# EAGLE design single_channel_-_Rev_C_-_Part_1 (EAGLE 6.1)
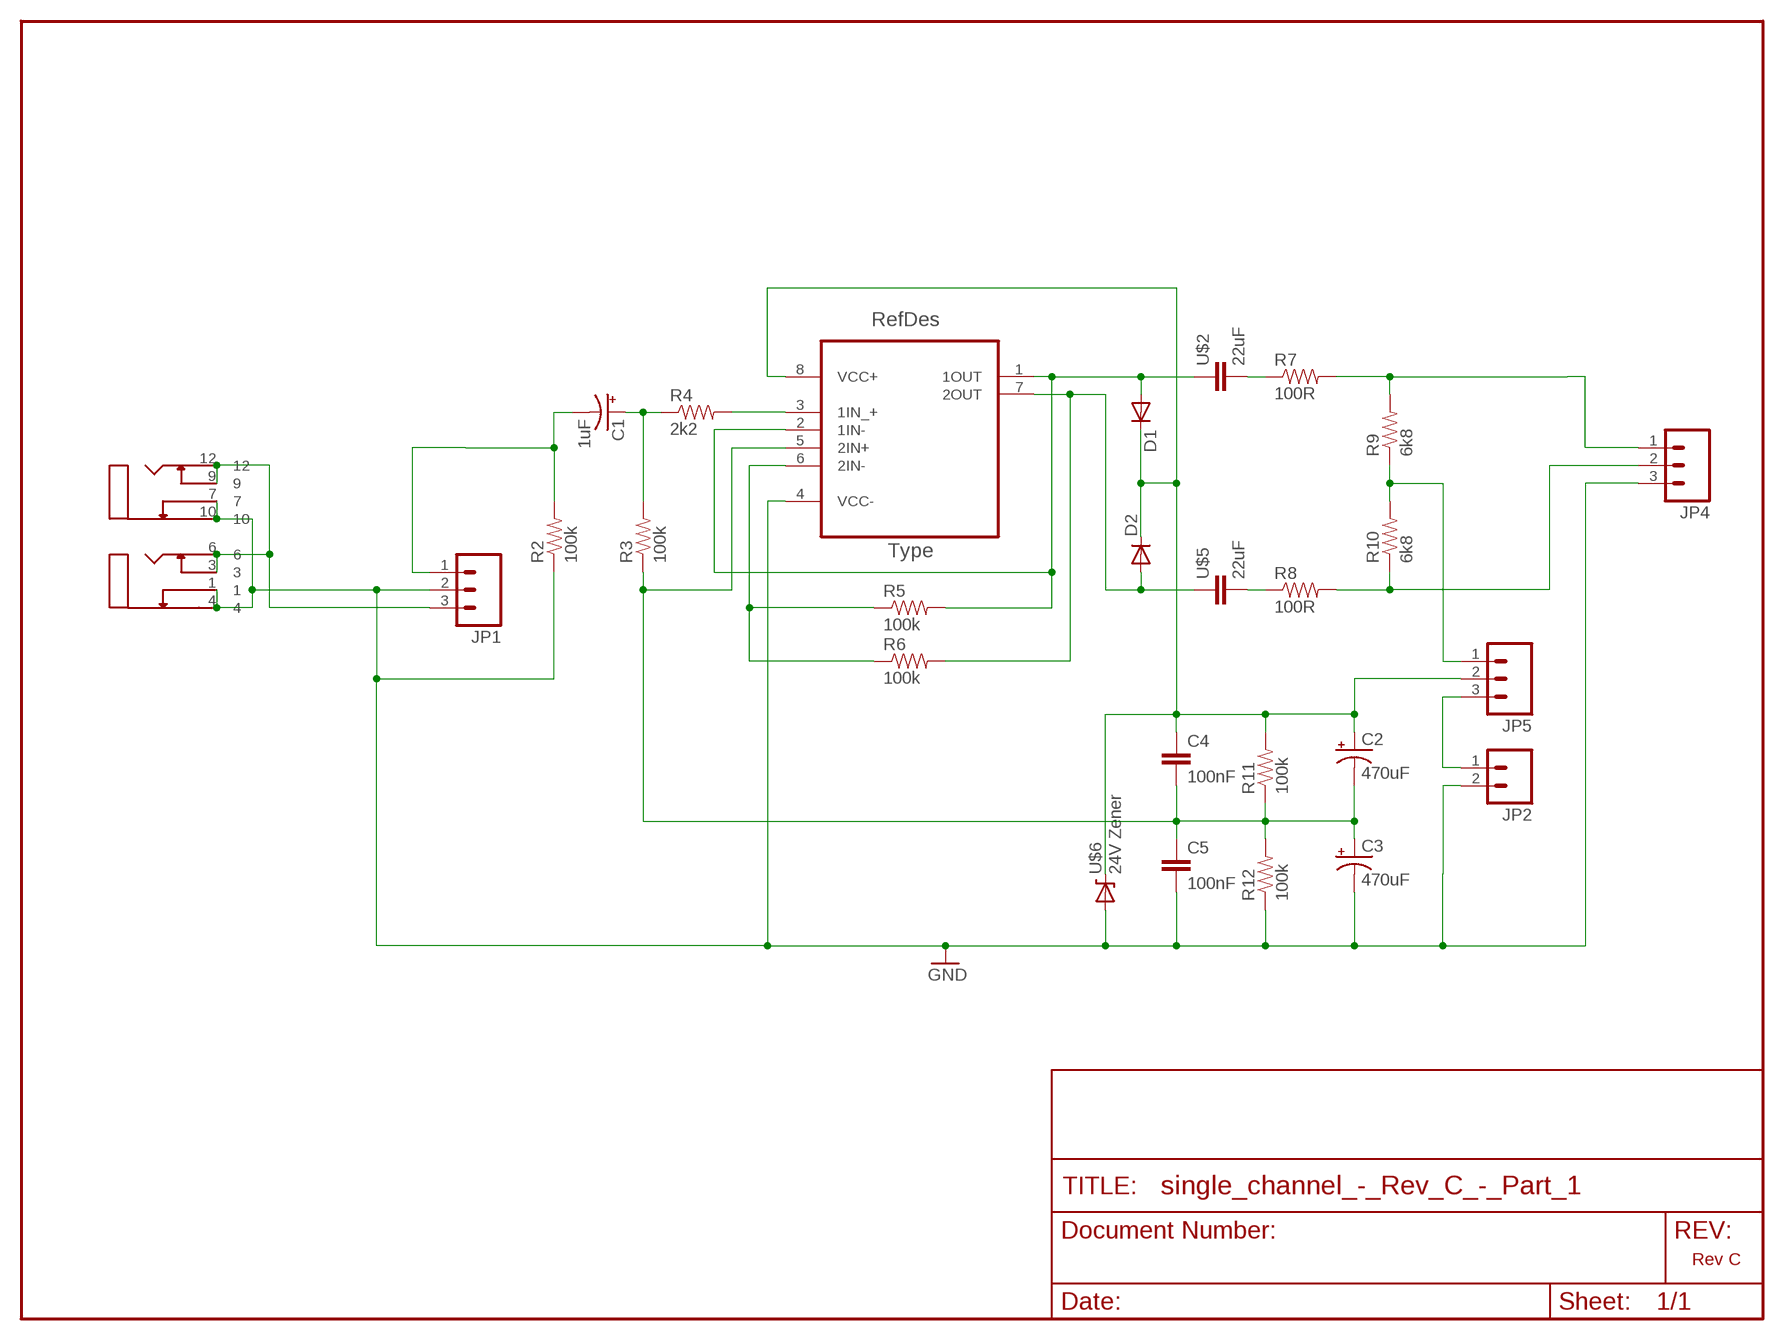
[diagram p0: schematic, sheet 1]

## Parts
C1  1uF  CAP_POLPTH2  [CPOL-RADIAL-10UF-25V]
C2  470uF  CAP_POLPTH4  [CPOL-RADIAL-1000UF-25V]
C3  470uF  CAP_POLPTH4  [CPOL-RADIAL-1000UF-25V]
C4  100nF  CAPPTH1  [CAP-PTH-5MM]
C5  100nF  CAPPTH1  [CAP-PTH-5MM]
D1  DIODE1N4148  [DIODE-1N4148]
D2  DIODE1N4148  [DIODE-1N4148]
J1  ACJMMHD  [MHD]
JP1  M03LONGPADS  [1X03_LONGPADS]
JP2  M02PTH3  [1X02_LONGPADS]
JP4  M03LONGPADS  [1X03_LONGPADS]
JP5  M03LONGPADS  [1X03_LONGPADS]
R2  100k  RESISTORPTH-1/2W  [AXIAL-0.5]
R3  100k  RESISTORPTH-1/2W  [AXIAL-0.5]
R4  2k2  RESISTORPTH-1/2W  [AXIAL-0.5]
R5  100k  RESISTORPTH-1/2W  [AXIAL-0.5]
R6  100k  RESISTORPTH-1/2W  [AXIAL-0.5]
R7  100R  RESISTORPTH-1/2W  [AXIAL-0.5]
R8  100R  RESISTORPTH-1/2W  [AXIAL-0.5]
R9  6k8  RESISTORPTH-1/2W  [AXIAL-0.5]
R10  6k8  RESISTORPTH-1/2W  [AXIAL-0.5]
R11  100k  RESISTORPTH-1/2W  [AXIAL-0.5]
R12  100k  RESISTORPTH-1/2W  [AXIAL-0.5]
U1  TL072CP  [DIP254P762X508-8]
U$2  22uF  CAP8MM  [8MM]
U$5  22uF  CAP8MM  [8MM]
U$6  24V Zener  DIODE-ZENERPTH  [DIODE-ZENER]

## Nets
GND: C3.2(-) C5.2 J1.1 J1.4 J1.7 J1.10 JP1.2 JP2.2 JP4.3 R2.P$1 R12.P$1 U1.4(VCC-) U$6.P$2(A)
N$2: J1.3 J1.6 J1.9 J1.12 JP1.3
N$5: C1.2(-) JP1.1 R2.P$2
N$6: C1.1(+) R3.P$2 R4.P$1
N$7: D1.A R5.P$2 U1.1(1OUT) U1.2(1IN-) U$2.P$1
N$8: R4.P$2 U1.3(1IN_+)
N$9: R5.P$1 R6.P$1 U1.6(2IN-)
N$10: C2.2(-) C3.1(+) C4.2 C5.1 R3.P$1 R11.P$1 R12.P$2 U1.5(2IN+)
N$11: C2.1(+) C4.1 D1.C D2.C JP5.2 R11.P$2 U1.8(VCC+) U$6.P$1(C)
N$12: D2.A R6.P$2 U1.7(2OUT) U$5.P$1
N$13: JP4.2 R8.P$2 R10.P$1
N$14: JP5.1 R9.P$1 R10.P$2
N$15: JP4.1 R7.P$2 R9.P$2
N$16: R7.P$1 U$2.P$2
N$17: R8.P$1 U$5.P$2
N$19: JP2.1 JP5.3

## Notes on the sheet
- Rev C

## Library data of the parts
C1 = SparkFun:CAP_POL: Capacitor Polarized These are standard SMD and PTH capacitors. Normally 10uF, 47uF, and 100uF in electrolytic and tantalum varieties. Always verify the external diameter of the through hole cap, it varies with capacity, voltage, and manufacturer. The EIA devices should be standard.
C2 C3 = SparkFun-Passives:CAP_POL: Capacitor Polarized These are standard SMD and PTH capacitors. Normally 10uF, 47uF, and 100uF in electrolytic and tantalum varieties. Always verify the external diameter of the through hole cap, it varies with capacity, voltage, and manufacturer. The EIA devices should be standard.
C4 C5 = SparkFun:CAP: Capacitor Standard 0603 ceramic capacitor, and 0.1" leaded capacitor.
D1 D2 = SparkFun:DIODE: Diode These are standard reverse protection diodes and small signal diodes. SMA package can handle up to about 1A. SOD-323 can handle about 200mA. What the SOD-323 package when ordering, there are some mfgs out there that are 5-pin packages.
J1 = con-audio:ACJM: ACJM-MHD dual mono 14/" jack plug
JP1 JP4 JP5 = SparkFun-Connectors:M03: Header 3 Standard 3-pin 0.1" header. Use with straight break away headers (SKU : PRT-00116), right angle break away headers (PRT-00553), swiss pins (PRT-00743), machine pins (PRT-00117), and female headers (PRT-00115). Molex polarized connector foot print use with SKU : PRT-08232 with associated crimp pins and housings.
JP2 = SparkFun-Connectors:M02: Header 2 Standard 2-pin 0.1" header. Use with straight break away headers (SKU : PRT-00116), right angle break away headers (PRT-00553), swiss pins (PRT-00743), machine pins (PRT-00117), and female headers (PRT-00115). Molex polarized connector foot print use with SKU : PRT-08233 with associated crimp pins and housings.
R2-R12 = SparkFun:RESISTOR: Resistor Basic schematic elements and footprints for 0603, 1206, and PTH resistors.
U1 = ic-amplifiers:TL072CP; DESCRIPTION: OPERATIONAL AMPLIFIER; MPN: TL072CP; OC_FARNELL: 1106015; OC_NEWARK: 60K6988; PACKAGE: PDIP; SUPPLIER: Texas Instruments
U$2 U$5 = passive-capacitors:CAP
U$6 = SparkFun:DIODE-ZENER: Zener Diode Production Part - 8199 3.4V Zener Voltage

## Board
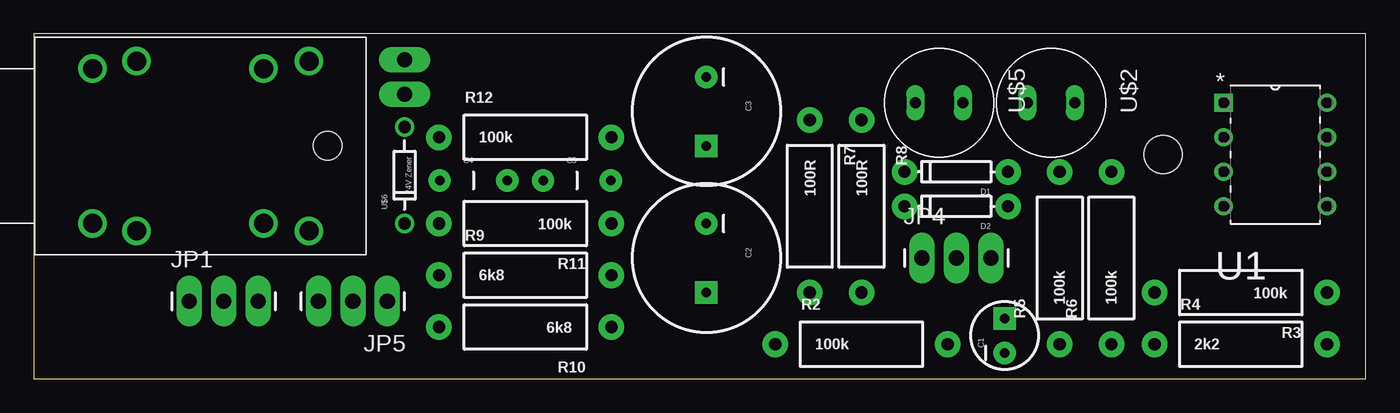
[diagram p1: board, top side]
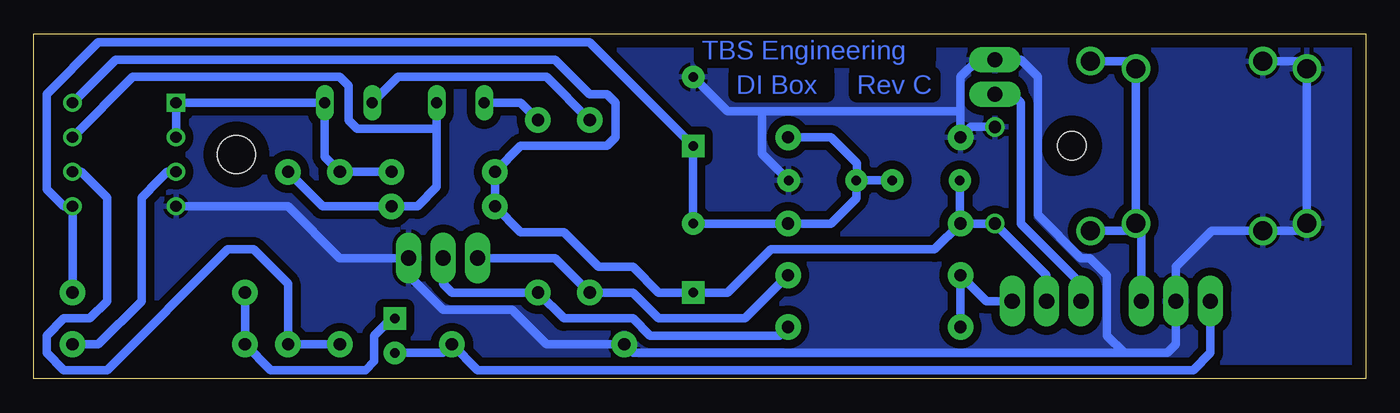
[diagram p2: board, bottom side, seen from below]

Size 98.09 x 25.39 mm. Coordinates in mm from the lower left corner, seen from the top.
Outline: 0,0 98.09,0 98.09,25.39 0,25.39 0,0
Copper layers (1*16): Top 0.035mm / dielectric 1.5mm / Bottom 0.035mm
Design rules: minimum track width 10mil, minimum drill 24mil, track to track 8mil, track to pad 8mil, pad to pad 8mil, via to via 8mil, smd to smd 8mil, copper to edge 40mil, drill to drill 8mil, minimum pad ring 10mil, minimum via ring 8mil, stop-mask expansion 4mil, vias tented up to drill 0mil, thermal gap 10mil
Holes 2.8 mm at 83.19,16.51
tKeepout: area 0,0 to 28.6,8.9

### Footprints (pad centres in the part's own frame; a part is rotated, then mirrored left to right if it is on the bottom)
CPOL-RADIAL-10UF-25V = drill 0.7 pad 1.651 square: 1 1.27,0 | drill 0.7 pad 1.651: 2 -1.27,0
CPOL-RADIAL-1000UF-25V = drill 0.7 pad 1.651 square: 1 2.54,0 | drill 0.7 pad 1.651: 2 -2.54,0
CAP-PTH-5MM = drill 0.7 pad 1.651: 1 -2.5,0; 2 2.5,0
DIODE-1N4148 = drill 0.9 pad 1.88: A -3.81,0; C 3.81,0
MHD = drill 1.4: 1 0,-5.7; 3 -12.6,-5.7; 4 0,5.7; 6 -12.6,5.7; 7 -3.25,-6.25; 9 -15.95,-6.25; 10 -3.25,6.25; 12 -15.95,6.25 | hole 2.1: -17.33,0
1X03_LONGPADS = drill 1.118 pad 1.88 long: 1 0,0; 2 2.54,0; 3 5.08,0
1X02_LONGPADS = drill 1.118 pad 1.88 long: 1 0,0; 2 2.54,0
AXIAL-0.5 = drill 0.9 pad 1.88: P$1 -6.35,0; P$2 6.35,0
DIP254P762X508-8 = drill 0.838 square: 1 -7.62,7.62 | drill 0.838: 2 -7.62,5.08; 3 -7.62,2.54; 4 -7.62,0; 5 0,0; 6 0,2.54; 7 0,5.08; 8 0,7.62
8MM = drill 0.8 long: P$1 0,1.75; P$2 0,-1.75
DIODE-ZENER = drill 0.9: P$1 -3.556,0; P$2 3.556,0

### Placement (x,y rotation side)
C1  71.5,3.17 90 top
C2  49.53,8.89 270 top
C3  49.53,19.68 270 top
C4  32.38,14.61 0 top
C5  40.01,14.61 0 top
D1  67.94,15.24 180 top
D2  67.94,12.7 180 top
J1  4.32,17.14 180 top
JP1  11.43,5.71 0 top
JP2  27.3,20.95 90 top
JP4  65.41,8.89 0 top
JP5  26.04,5.71 180 top
R2  60.96,2.54 0 top
R3  88.9,6.35 180 top
R4  88.9,2.54 0 top
R5  75.56,8.89 90 top
R6  79.38,8.89 90 top
R7  57.15,12.7 270 top
R8  60.96,12.7 270 top
R9  36.2,7.62 0 top
R10  36.2,3.81 180 top
R11  36.2,11.43 180 top
R12  36.2,17.78 0 top
U1  95.25,12.7 0 top
U$2  74.93,20.32 270 top
U$5  66.67,20.32 270 top
U$6  27.3,14.99 90 top

### Tracks (layer width: path | path; a pad name or v marks a point on that pad's centre or on a via)
GND
  Bottom 0.61: 17.78,1.91 14.61,1.91 13.97,2.54 JP1.2 13.97,8.26 11.33,10.89 J1.10 4.87,10.89 J1.4 J1.1 4.87,23.39 J1.7 | 17.78,1.91 52.7,1.91 53.98,1.91 R2.P$1 60.33,2.54 62.87,5.08 67.94,5.08 70.48,7.62 JP4.3 75.56,8.89 79.38,12.7 U1.4 | 17.78,1.91 19.05,3.17 19.05,7.62 20.32,8.89 20.95,8.89 24.13,12.06 24.13,22.23 25.4,23.5 JP2.2 28.57,23.5 29.84,22.23 29.84,19.68 | U$6.P$2 29.08,18.54 R12.P$1 29.84,19.68 | C3.2 46.99,19.68 44.45,19.68 | 44.45,19.68 29.84,19.68 | C5.2 44.45,16.55 44.45,19.68
  pour Bottom (isolate 0.61): 0,0 97.79,0 97.79,25.4 0,25.4
N$2
  Bottom 0.61: J1.12 17.47,10.89 J1.6 | J1.9 17.47,23.39 J1.3 J1.6 | J1.6 16.51,11.04 JP1.3
N$5
  Bottom 0.61: JP1.1 11.43,1.91 12.7,0.64 52.07,0.64 65.41,0.64 R2.P$2 67.94,1.91 C1.2
N$6
  Bottom 0.61: C1.1 71.75,4.45 73.03,3.17 73.03,1.27 73.66,0.64 80.64,0.64 R4.P$1 R3.P$2
N$7
  Bottom 0.61: U1.2 U1.1 U$2.P$1 76.68,16.36 R5.P$2 D1.A
N$8
  Bottom 0.61: U1.3 88.27,15.24 88.9,14.61 90.17,13.34 90.17,5.71 93.34,2.54 R4.P$2
N$9
  Bottom 0.61: U1.6 94.61,15.24 92.71,13.34 92.71,5.71 93.98,4.45 95.89,4.45 97.16,3.17 97.16,1.91 95.89,0.64 92.71,0.64 83.82,9.53 81.92,9.53 79.38,6.99 R6.P$1 R5.P$1
N$10
  Bottom 0.61: C4.2 C5.1 | R12.P$2 39.37,17.78 37.47,15.88 37.47,14.64 C5.1 | C5.1 37.51,13.29 39.37,11.43 R11.P$1 C2.2 C3.1 57.15,24.77 93.34,24.77 97.16,20.95 97.16,13.97 95.89,12.7 U1.5 95.25,12.06 R3.P$1
N$11
  Bottom 0.61: JP5.2 23.5,7.62 U$6.P$1 R11.P$2 | C4.1 29.89,11.47 R11.P$2 | R11.P$2 31.75,9.53 43.81,9.53 46.99,6.35 C2.1 52.07,6.35 53.98,8.26 56.52,8.26 59.05,10.79 62.23,10.79 D2.C D1.C 62.23,17.14 55.88,17.14 55.24,17.78 55.24,20.32 55.88,20.95 56.52,20.95 57.15,20.95 59.69,23.5 60.33,23.5 92.08,23.5 U1.8
N$12
  Bottom 0.61: U$5.P$1 68.42,18.41 | 68.42,18.41 68.42,14.12 69.85,12.7 D2.A 76.83,12.7 R6.P$2 | U1.7 90.81,22.23 75.56,22.23 74.93,21.59 74.93,19.05 74.3,18.41 68.42,18.41
N$13
  Bottom 0.61: R10.P$1 43.18,3.17 52.7,3.17 53.98,4.45 59.05,4.45 R8.P$2 67.31,6.35 67.94,6.99 JP4.2
N$14
  Bottom 0.61: R10.P$2 R9.P$1 27.94,5.71 JP5.1
N$15
  Bottom 0.61: R9.P$2 45.72,4.45 52.07,4.45 53.98,6.35 R7.P$2 59.69,8.89 JP4.1
N$16
  Bottom 0.61: R7.P$1 60.33,22.23 69.85,22.23 71.28,22.23 U$2.P$2
N$17
  Bottom 0.61: U$5.P$2 62.23,20.32 R8.P$1
N$19
  Bottom 0.61: JP2.1 26.04,20.95 25.4,20.32 25.4,11.43 20.95,6.99 JP5.3

### Text on the board
Bottom: TBS Engineering | Rev C | DI Box